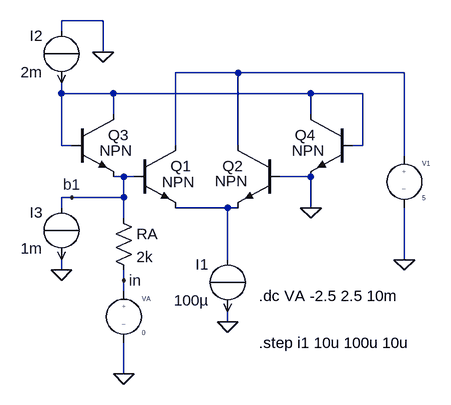
[diagram p0: schematic mult-2q-einfach.asc]
mult-2q-einfach.asc, the LTspice schematic file:
Version 4
SHEET 1 880 1028
WIRE 112 -272 48 -272
WIRE 48 -256 48 -272
WIRE 112 -224 112 -272
WIRE 320 -192 224 -192
WIRE 576 -192 320 -192
WIRE 48 -160 48 -176
WIRE 128 -160 48 -160
WIRE 432 -160 128 -160
WIRE 512 -160 432 -160
WIRE 128 -128 128 -160
WIRE 432 -128 432 -160
WIRE 48 -80 48 -160
WIRE 64 -80 48 -80
WIRE 224 -80 224 -192
WIRE 320 -80 320 -192
WIRE 512 -80 512 -160
WIRE 512 -80 496 -80
WIRE 576 -64 576 -192
WIRE 144 -32 128 -32
WIRE 160 -32 144 -32
WIRE 432 -32 384 -32
WIRE 64 0 48 0
WIRE 144 0 144 -32
WIRE 144 0 64 0
WIRE 48 16 48 0
WIRE 304 16 224 16
WIRE 320 16 304 16
WIRE 432 16 432 -32
WIRE 144 32 144 0
WIRE 304 96 304 16
WIRE 576 96 576 16
WIRE 48 112 48 96
WIRE 144 128 144 112
WIRE 144 144 144 128
WIRE 304 192 304 176
WIRE 144 272 144 224
FLAG 144 272 0
FLAG 576 96 0
FLAG 304 192 0
FLAG 432 16 0
FLAG 48 112 0
FLAG 112 -224 0
FLAG 64 0 b1
FLAG 144 128 in
SYMBOL source-V 144 128 R0
SYMATTR InstName VA
SYMATTR Value 0
SYMBOL source-V 576 -80 R0
SYMATTR InstName V1
SYMATTR Value 5
SYMBOL EIT_Semiconductors\\npn 160 -80 R0
WINDOW 3 43 56 Left 2
SYMATTR InstName Q1
SYMBOL EIT_Semiconductors\\npn 384 -80 M0
WINDOW 3 49 55 Left 2
SYMATTR InstName Q2
SYMBOL source-I 304 176 R180
WINDOW 0 29 73 Left 2
WINDOW 3 29 17 Left 2
WINDOW 123 0 0 Left 2
WINDOW 39 0 0 Left 2
SYMATTR InstName I1
SYMATTR Value 100µ
SYMBOL EIT_Semiconductors\\npn 64 -128 R0
WINDOW 3 43 56 Left 2
SYMATTR InstName Q3
SYMBOL EIT_Semiconductors\\npn 496 -128 M0
WINDOW 3 43 56 Left 2
SYMATTR InstName Q4
SYMBOL res 128 16 R0
SYMATTR InstName RA
SYMATTR Value 2k
SYMBOL source-I 48 -176 R180
WINDOW 0 29 73 Left 2
WINDOW 3 29 17 Left 2
SYMATTR InstName I2
SYMATTR Value 2m
SYMBOL source-I 48 96 R180
WINDOW 0 29 73 Left 2
WINDOW 3 29 17 Left 2
SYMATTR InstName I3
SYMATTR Value 1m
TEXT 352 152 Left 2 !.dc VA -2.5 2.5 10m
TEXT 352 224 Left 2 !.step i1 10u 100u 10u

The netlist it stands for:
* mult-2q-einfach.asc
VA in 0 0
V1 N001 0 5
Q1 N001 b1 N003 0 NPN
Q2 N001 0 N003 0 NPN
I1 N003 0 100µ
Q3 N002 N002 b1 0 NPN
Q4 N002 N002 0 0 NPN
RA b1 in 2k
I2 0 N002 2m
I3 b1 0 1m
.model NPN NPN
.model PNP PNP
.lib standard.bjt
.dc VA -2.5 2.5 10m
.step i1 10u 100u 10u
.backanno
.end